# Altium schematic sheet walktimizer_v2.SchDoc
size 431 x 279 mm; SheetNumber: 1; SheetTotal: 1; ENG_APP_DATE: --/--/--; DSN_APP_DATE: --/--/--; CHK_APP_DATE: --/--/--
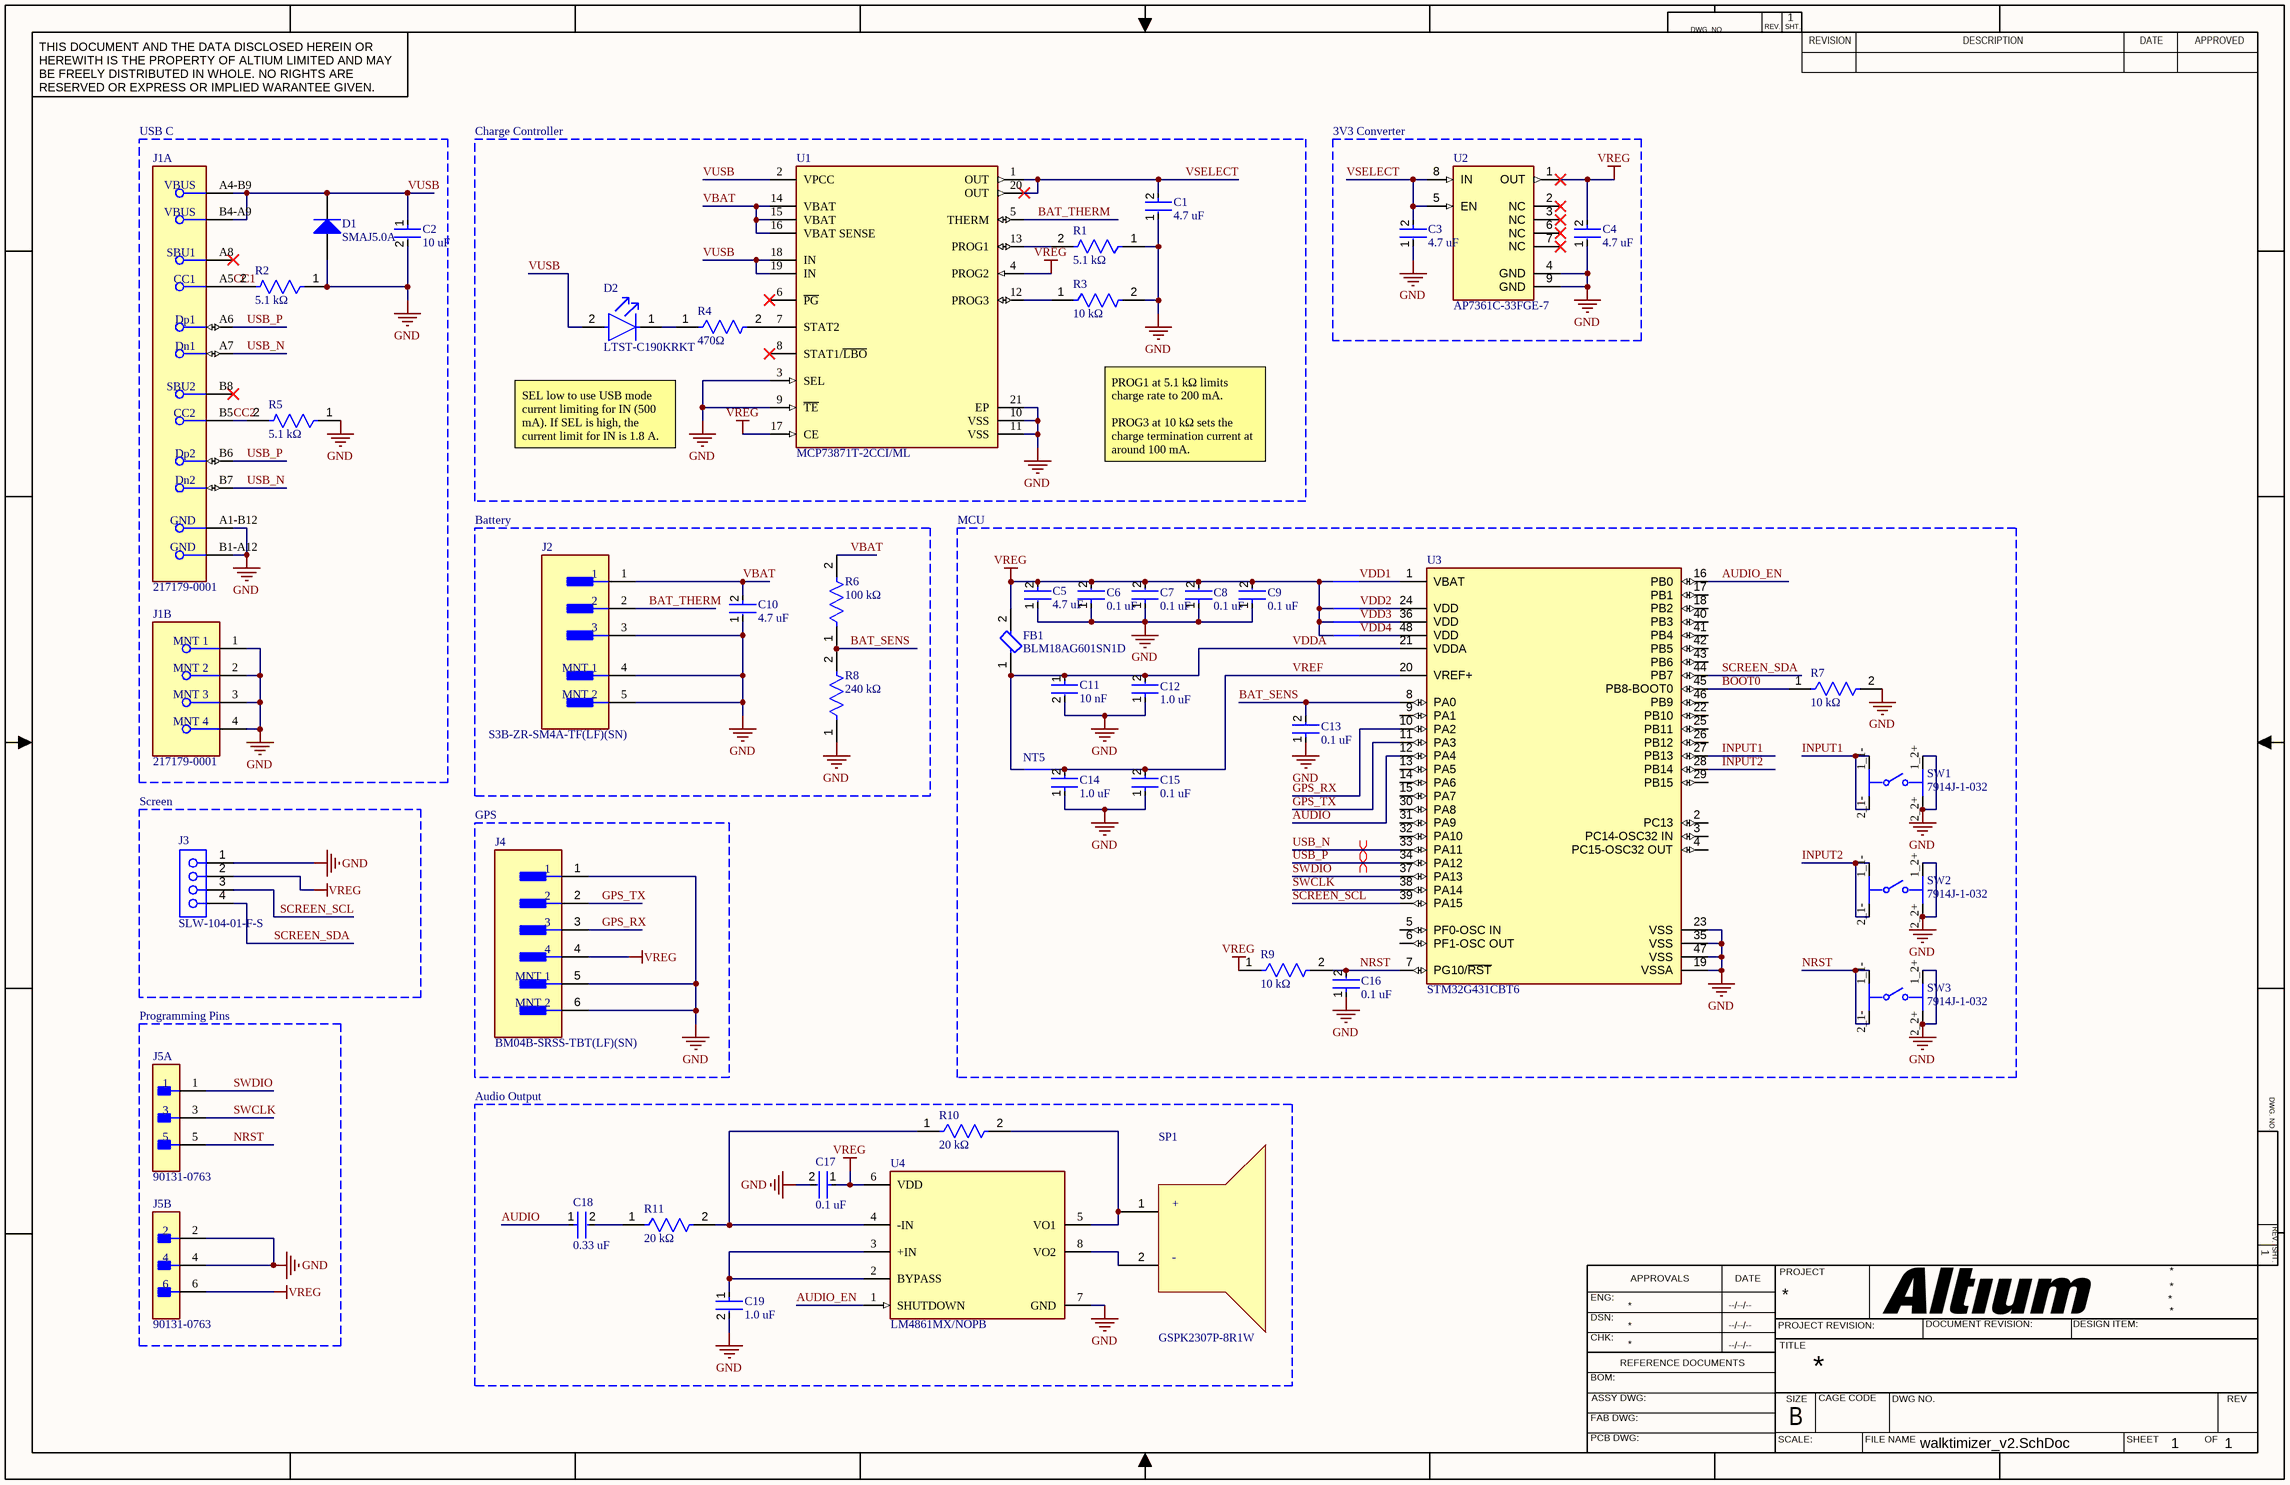
[diagram p0: walktimizer_v2.SchDoc]

## Parts
C1  4.7 uF  [FP-GRM188-0_1-MFG]
C2  10 uF  [FP-GRM21B-0_2-e0_2_0_7-IPC_A]
C3  4.7 uF  [FP-GRM188-0_1-MFG]
C4  4.7 uF  [FP-GRM188-0_1-MFG]
C5  4.7 uF  [FP-GRM188-0_1-MFG]
C6  0.1 uF  [FP-CC0603-DA-MFG]
C7  0.1 uF  [FP-CC0603-DA-MFG]
C8  0.1 uF  [FP-CC0603-DA-MFG]
C9  0.1 uF  [FP-CC0603-DA-MFG]
C10  4.7 uF  [FP-GRM188-0_1-MFG]
C11  10 nF  [FP-CC0603-DA-MFG]
C12  1.0 uF  [FP-CC0603-DB-MFG]
C13  0.1 uF  [FP-CC0603-DA-MFG]
C14  1.0 uF  [FP-CC0603-DB-MFG]
C15  0.1 uF  [FP-CC0603-DA-MFG]
C16  0.1 uF  [FP-CC0603-DA-MFG]
C17  0.1 uF  [FP-CC0603-DA-MFG]
C18  0.33 uF  [FP-CC0603-DA-MFG]
C19  1.0 uF  [FP-CC0603-DB-MFG]
D1  SMAJ5.0A  [BOUR-SMA-2_V]
D2  LTST-C190KRKT  [FP-LTST-C190KRKT-MFG]
FB1  BLM18AG601SN1D  [FP-BLM18-0_15-t0_8-MFG]
J1  217179-0001  [FP-2171790001-MFG]  (parts A,B of 2)
J2  S3B-ZR-SM4A-TF(LF)(SN)  [FP-S3B-ZR-SM4A-TF_LF_SN-MFG]
J3  SLW-104-01-F-S  [SMTC-SLW-104-01-X-S]
J4  BM04B-SRSS-TBT(LF)(SN)  [FP-BM04B-SRSS-TBT_LF_SN-MFG]
J5  90131-0763  [FP-90131-0763-MFG]  (parts A,B of 2)
NT1  NT  [NETTIE_SMD]  (value not drawn)  (net tie, no BOM)
NT2  NT  [NETTIE_SMD]  (value not drawn)  (net tie, no BOM)
NT3  NT  [NETTIE_SMD]  (value not drawn)  (net tie, no BOM)
NT4  NT  [NETTIE_SMD]  (value not drawn)  (net tie, no BOM)
NT5  NT  [NETTIE_SMD]  (value not drawn)  (net tie, no BOM)
R1  5.1 kΩ  [FP-CRCW0603-e3-IPC_C]
R2  5.1 kΩ  [FP-CRCW0603-e3-IPC_C]
R3  10 kΩ  [FP-RC0603-0_55-IPC_C]
R4  470Ω  [FP-CRCW0603-e3-MFG]
R5  5.1 kΩ  [FP-CRCW0603-e3-IPC_C]
R6  100 kΩ  [FP-RC0603-0_55-MFG]
R7  10 kΩ  [FP-RC0603-0_55-IPC_C]
R8  240 kΩ  [FP-RT0603-MFG]
R9  10 kΩ  [FP-RC0603-0_55-IPC_C]
R10  20 kΩ  [FP-RC0603-0_55-IPC_C]
R11  20 kΩ  [FP-RC0603-0_55-IPC_C]
SP1  GSPK2307P-8R1W  [GSPK2307P-8R1W-Footprint-1]
SW1  7914J-1-032  [FP-7914J-1-032-MFG]
SW2  7914J-1-032  [FP-7914J-1-032-MFG]
SW3  7914J-1-032  [FP-7914J-1-032-MFG]
U1  MCP73871T-2CCI/ML  [FP-C04-126-IPC_C]
U2  AP7361C-33FGE-7  [FP-U-DFN3030-8_Type_E-MFG]
U3  STM32G431CBT6  [FP-LQFP48-5B-MFG]
U4  LM4861MX/NOPB  [FP-D0008A-MFG]

## Blocks framed on the sheet
USB C: C2 D1 J1 R2 R5
Charge Controller: C1 D2 R1 R3 R4 U1
3V3 Converter: C3 C4 U2
Battery: C10 J2 R6 R8
MCU: C5-C9 C11-C16 FB1 NT1-NT5 R7 R9 SW1-SW3 U3
Screen: J3
GPS: J4
Programming Pins: J5
Audio Output: C17-C19 R10 R11 SP1 U4

## Nets
GND: C1.1 C2.2 C3.1 C4.1 C5.1 C6.1 C7.1 C8.1 C9.1 C10.1 C11.2 C12.1 C13.1 C14.1 C15.1 C16.1 C17.2 C19.2 D1.1(A) J1.1(MNT_1) J1.2(MNT_2) J1.3(MNT_3) J1.4(MNT_4) J1.A1-B12(GND) J1.B1-A12(GND) J2.3 J2.4(MNT_1) J2.5(MNT_2) J3.1 J4.1 J4.5(MNT_1) J4.6(MNT_2) J5.2 J5.4 R1.1 R2.1 R3.2 R5.1 R7.2 R8.1 SW1.1_2+(1_2+) SW1.2_2+(2_2+) SW2.1_2+(1_2+) SW2.2_2+(2_2+) SW3.1_2+(1_2+) SW3.2_2+(2_2+) U1.3(SEL) U1.9(~{TE}) U1.10(VSS) U1.11(VSS) U1.21(EP) U2.4(GND) U2.9(GND) U3.19(VSSA) U3.23(VSS) U3.35(VSS) U3.47(VSS) U4.7(GND)
VREG: C4.2 C5.2 C6.2 C7.2 C8.2 C9.2 C17.1 FB1.2 J3.2 J4.4 J5.6 NT1.1 NT2.1 NT3.1 NT4.1 R9.1 U1.4(PROG2) U1.17(CE) U2.1(OUT) U4.6(VDD)
AUDIO: C18.1 U3.12(PA4)
AUDIO_EN: U3.16(PB0) U4.1(SHUTDOWN)
BAT_SENS: C13.2 R6.1 R8.2 U3.8(PA0)
BAT_THERM: J2.2 U1.5(THERM)
BOOT0: R7.1 U3.45(PB8-BOOT0)
CC1: J1.A5(CC1) R2.2
CC2: J1.B5(CC2) R5.2
GPS_RX: J4.3 U3.10(PA2)
GPS_TX: J4.2 U3.11(PA3)
INPUT1: SW1.1_1-(1_1-) SW1.2_1-(2_1-) U3.27(PB13)
INPUT2: SW2.1_1-(1_1-) SW2.2_1-(2_1-) U3.28(PB14)
NRST: C16.2 J5.5 R9.2 SW3.1_1-(1_1-) SW3.2_1-(2_1-) U3.7(PG10/~{RST})
SCREEN_SCL: J3.3 U3.39(PA15)
SCREEN_SDA: J3.4 U3.44(PB7)
SWCLK: J5.3 U3.38(PA14)
SWDIO: J5.1 U3.37(PA13)
USB_N: J1.A7(Dn1) J1.B7(Dn2) U3.33(PA11)
USB_P: J1.A6(Dp1) J1.B6(Dp2) U3.34(PA12)
VBAT: C10.2 J2.1 R6.2 U1.14(VBAT) U1.15(VBAT) U1.16(VBAT_SENSE)
VDD1: NT1.2 U3.1(VBAT)
VDD2: NT2.2 U3.24(VDD)
VDD3: NT3.2 U3.36(VDD)
VDD4: NT4.2 U3.48(VDD)
VDDA: C11.1 C12.2 FB1.1 NT5.1 U3.21(VDDA)
VREF: C14.2 C15.2 NT5.2 U3.20(VREF+)
VSELECT: C1.2 C3.2 U1.1(OUT) U1.20(OUT) U2.5(EN) U2.8(IN)
VUSB: C2.1 D1.2(K) D2.2(A) J1.A4-B9(VBUS) J1.B4-A9(VBUS) U1.2(VPCC) U1.18(IN) U1.19(IN)
NetC18_2: C18.2 R11.1
NetC19_1: C19.1 U4.2(BYPASS) U4.3(+IN)
NetD2_1: D2.1(C) R4.1
NetR1_2: R1.2 U1.13(PROG1)
NetR3_1: R3.1 U1.12(PROG3)
NetR4_2: R4.2 U1.7(STAT2)
NetR10_1: R10.1 R11.2 U4.4(-IN)
NetR10_2: R10.2 SP1.1 U4.5(VO1)
NetSP1_2: SP1.2 U4.8(VO2)

Not connected (* = marked no-connect by the designer): J1 A8(SBU1)* B8(SBU2)*; U1 6(~{PG})* 8(STAT1/~{LBO})*; U2 2(NC)* 3(NC)* 6(NC)* 7(NC)*; U3 2(PC13) 3(PC14-OSC32_IN) 4(PC15-OSC32_OUT) 5(PF0-OSC_IN) 6(PF1-OSC_OUT) 9(PA1) 13(PA5) 14(PA6) 15(PA7) 17(PB1) 18(PB2) 22(PB10) 25(PB11) 26(PB12) 29(PB15) 30(PA8) 31(PA9) 32(PA10) 40(PB3) 41(PB4) 42(PB5) 43(PB6) 46(PB9)

## Layout directives
differential pair: USB_N, USB_P

## Notes on the sheet
- SEL low to use USB mode current limiting for IN (500 mA). If SEL is high, the current limit for IN is 1.8 A.
- PROG1 at 5.1 kΩ limits charge rate to 200 mA.
  PROG3 at 10 kΩ sets the charge termination current at around 100 mA.
- DWG. NO.
- REV.
- SHT.
- THIS DOCUMENT AND THE DATA DISCLOSED HEREIN OR HEREWITH IS THE PROPERTY OF ALTIUM LIMITED AND MAY BE FREELY DISTRIBUTED IN WHOLE. NO RIGHTS ARE RESERVED OR EXPRESS OR IMPLIED WARANTEE GIVEN.
- REVISION
- DESCRIPTION
- DATE
- APPROVED
- ENG:
- APPROVALS
- PROJECT
- DSN:
- CHK:
- REFERENCE DOCUMENTS
- PROJECT REVISION:
- TITLE
- DOCUMENT REVISION:
- DESIGN ITEM:
- BOM:
- FAB DWG:
- PCB DWG:
- ASSY DWG:
- SCALE:
- SIZE
- B
- CAGE CODE
- FILE NAME
- DWG NO.
- SHEET
- OF
- REV
- (in symbol CMP-00027-00003-3) +; -

## Library data of the parts
C1 C3-C5 C10 = CMP-2006-02799-3: CAP CER 4.7UF 6.3V X5R 0603 / GRM188R60J475KE19D; Material: Ceramic; Tolerance: 10%; Max Operating Temperature: 85°C; REACH SVHC: No SVHC; Thickness: 0.035inch; Voltage Rating: 6.3V; Package Quantity: 1; Radiation Hardening: No; Capacitance: 4.7uF; Voltage: 6.3V; Case Code (Metric): 1608; Dielectric: X5R; Mount: Surface Mount; RoHS Compliant: Yes; Height: 0.8mm; Voltage Rating (DC): 6.3V; Width: 0.8mm; Lead Free: Lead Free; Case Code (Imperial): 0603; Packaging: Tape and Reel; Length: 1.6mm; Case/Package: 0603; Termination: SMD/SMT; Min Operating Temperature: -55°C; Depth: 0.8mm
C2 = CMP-06035-004402-1: Chip Multilayer Ceramic Capacitors for General Purpose, 0805, 10uF, X5R, 15%, 10%, 50V / GRM21BR61H106KE43L; Voltage Rating (DC): 50V; Dielectric: X5R; Tolerance: 10%; Capacitance: 10uF; Thickness: 1.25mm; Length: 2mm; Width: 1.25mm
C6-C9 C13 C15-C17 = CMP-2100-03601-2: CAP CER 0.1UF 50V X7R 0603 / CC0603KRX7R9BB104; Manufacturer: YAGEO; Material: Ceramic; Capacitance: 100 nF; Temperature Coefficient: 15%; Tolerance: 0.1; Value: 100 nF; Height: 0.9mm; Voltage: 50 V; ComponentLink2Description: Datasheet; Device Class L2: Capacitors; Temperature Range High: +125°C; Category: Cap; Footprint Url: http://www.yageo.com/exep/pages/download/literatures/UPY-C_GEN_24.pdf; ComponentLink2URL: http://www.yageo.com/documents/recent/UPY-GPHC_X7R_6.3V-to-50V_18.pdf; Package: CC0603-DA; Temperature: -55°C to +125°C; Voltage Rating: 50 V; Temperature Characteristic: X7R; Device Class L1: Passive Components; Temperature Range Low: -55°C; Manufacturer Part Number: CC0603KRX7R9BB104; RoHS: TRUE; Automotive: No; Device Class L3: Ceramic Capacitors; Octopart: https://octopart.com/cc0603krx7r9bb104-yageo-42244635; Mouser Description: Multilayer Ceramic Capacitor, CC Series, 0.1 - F, - 10%, X7R, 50 V, 0603 [1608 Metric]; Lead Free: Yes; Digikey Description: CAP CER 0.1UF 50V X7R 0603
C11 = CMP-2100-03600-2: CAP CER 10000PF 50V X7R 0603 / CC0603KRX7R9BB103; Manufacturer: YAGEO; Tolerance: 0.1; Material: Ceramic; Temperature Coefficient: 15%; Mouser Description: Multilayer Ceramic Capacitor, CC Series, 0.01 - F, - 10%, X7R, 50 V, 0603 [1608 Metric]; Digikey Description: CAP CER 10000PF 50V X7R 0603; Height: 0.9mm; Category: Cap; Temperature Characteristic: X7R; Footprint Url: http://www.yageo.com/exep/pages/download/literatures/UPY-C_GEN_24.pdf; Lead Free: Yes; Voltage Rating: 50 V; Manufacturer Part Number: CC0603KRX7R9BB103; Temperature: -55°C to +125°C; Device Class L3: Ceramic Capacitors; ComponentLink2Description: Datasheet; Voltage: 50 V; Package: CC0603-DA; Octopart: https://octopart.com/cc0603krx7r9bb103-yageo-192938; Automotive: No; Temperature Range High: +125°C; Temperature Range Low: -55°C; Value: 10 nF; RoHS: TRUE; Device Class L1: Passive Components; ComponentLink2URL: http://www.yageo.com/documents/recent/UPY-GPHC_X7R_6.3V-to-50V_18.pdf; Device Class L2: Capacitors; Capacitance: 10 nF
C12 C14 C19 = CMP-03422-000761-2: CAP CER 1UF 50V X7R 0603 / CC0603KRX7R9BB105; Tolerance: 10%; Lead Free: Lead Free; Max Operating Temperature: 125°C; Width: 0.031inch; Voltage Rating: 50V; Mount: Surface Mount; Resistor Type: Ceramic; Halogen Free: Halogen Free; Weight: 7.1E-05oz; Voltage Rating (DC): 50V; Package Quantity: 4000; Termination: SMD/SMT; Length: 0.063inch; Min Operating Temperature: -55°C; Dielectric: X7R; Case Code (Metric): 1608; Case Code (Imperial): 0603; Packaging: Tape and Reel; Thickness: 0.035inch; Capacitance: 1uF; Case/Package: 0603
C18 = CMP-03422-001097-1: CAP CER 0.33UF 25V X7R 0603 / CC0603KRX7R8BB334; Manufacturer: YAGEO; Temperature Coefficient: 15%; Value: 330 nF; Material: Ceramic; Tolerance: 0.1; Voltage: 25 V; Device Class L3: Ceramic Capacitors; Device Class L2: Capacitors; Voltage Rating: 25 V; Mouser Description: 0603 0.33 uF 25 V ±10 % Tolerance X7R SMT Multilayer Ceramic Capacitor; Automotive: No; ComponentLink2Description: Datasheet; Lead Free: Yes; Height: 0.9mm; Temperature: -55°C to +125°C; Capacitance: 330 nF; Digikey Description: CAP CER 0.33UF 25V X7R 0603; Temperature Range High: +125°C; Octopart: https://octopart.com/cc0603krx7r8bb334-yageo-47255252; Category: Cap; Package: CC0603-DA; Device Class L1: Passive Components; RoHS: TRUE; Manufacturer Part Number: CC0603KRX7R8BB334; Temperature Characteristic: X7R; ComponentLink2URL: http://www.yageo.com/documents/recent/UPY-GPHC_X7R_6.3V-to-50V_18.pdf; Temperature Range Low: -55°C; Footprint Url: http://www.yageo.com/exep/pages/download/literatures/UPY-C_GEN_24.pdf
D1 = CMP-2000-07090-1: SMAJ Transient Voltage Suppressor Diode Series, 3.5 V, -55 to 150 degC, 2-Pin SMA, RoHS, Tape and Reel; Manufacturer: Bourns; EDA / CAD Models: DownloadfromAcceleratedDesigns; Unidirectional Channels: 1; Voltage - Breakdown (Min): 6.4V; Voltage - Reverse Standoff (Typ): 5V; Voltage - Clamping (Max) @ Ipp: 9.2V; Other Names: SMAJ5.0ABDKR; Type: Zener; Catalog Drawings: SMAJSeriesFootprintSMAJ,SMBJSeries; Featured Product: SMAJ/SMBJ/SMCJ/SMLJDiscreteTVSDiodes; Power - Peak Pulse: 400W; Current - Peak Pulse (10/1000µs): 43.5A; Power Line Protection: No; Online Catalog: SMAJSeries; Supplier Device Package: SMA(DO-214AC); Operating Temperature: -55°C~150°C(TJ); Package Description: 2-Pin Surface Mount Device, Body 4.315 x 2.605 mm; Datasheet URL: https://datasheet.ciiva.com/25624/0900766b8112213b-25624680.pdf; Manufacturer URL: http://www.bourns.com/; Datasheet Version: 08/2012; Series: SMAJ; Family: TVS-Diodes; Bidirectional Channels: -; Applications: GeneralPurpose; Package Reference: SMA-2; Standard Package: 1; Package / Case: DO-214AC,SMA; Category: CircuitProtection; RoHS Information: SMAJSeriesMaterialDeclaration; Mounting Technology: SurfaceMount; Capacitance @ Frequency: -; Packaging: Digi-Reel®; Mounting Type: SurfaceMount
D2 = CMP-1674-00011-2: LED RED CLEAR CHIP SMD; Reverse Voltage: 5V; Viewing Angle: 130°; Power Rating: 75mW; Test Current: 20mA; Number of Elements: 1; Lens Color: Colorless; Wavelength: 639nm; Dominant Wavelength: 631nm; Lens Style: Diffused; Forward Current: 30mA; Forward Voltage: 2.4V; Luminous Intensity: 54mcd; Color: Red; Case Code (Imperial): 0603; Lens Transparency: Clear; Lead Free: Lead Free; Package Quantity: 1; Packaging: Tape and Reel; Max Operating Temperature: 85°C; Number of Pins: 2; Height: 0.8mm; Case/Package: 0603; Number of LEDs: 1; Width: 0.8mm; Case Code (Metric): 1608; Depth: 0.8mm; Mount: Surface Mount; Radiation Hardening: No; Length: 1.6mm; Illumination Color: Red; Power Dissipation: 75mW; Min Operating Temperature: -55°C
FB1 = CMP-0686-00436-3: Chip Ferrite Bead, 0603, 600Ω @ 100MHz, 0.38Ω, 25%, 500mA; Number of Lines: 1; Impedance: 600R; DC Resistance (DCR): 380mR; Material: Steel; Shielding: Unshielded; Max DC Current: 500mA; Termination: SMD/SMT; Military Standard: Not; Number of Circuits: 1; Min Operating Temperature: -55°C; Case Code (Imperial): 0603; Width: 0.8mm; Current Rating: 500mA; Lead Free: Lead Free; Packaging: Tape and Reel; Frequency: 100MHz; Max Operating Temperature: 125°C; DC Current: 500mA; REACH SVHC: No SVHC; Case/Package: 0603; Package Quantity: 1; Height: 0.8mm; Number of Pins: 2; Depth: 0.8mm; Test Frequency: 100MHz; Case Code (Metric): 1608; Tolerance: 25%; Core Material: Ferrite; Weight: 7.1E-05oz; Max Current Rating: 500mA; Radiation Hardening: No; Length: 1.6mm; RoHS Compliant: Yes
J1 = CMP-04767-000028-2: CONN RCP USB2.0 TYP C 24P SMD RA; NexarPartId: 117190526; Gender: Receptacle; Number of Contacts: 16; Current Rating: 1.25A; Voltage Rating: 30V; Min Operating Temperature: -40°C; USB Standard: USB 2.0; Height: 3.36mm; Contact Material: Gold, Nickel; Max Operating Temperature: 85°C
J2 = CMP-17439-000744-1: CONN HEADER SMD R/A 3POS 1.5MM; Number of Contacts: 3; Contact Resistance: 30mR; Gender: Male; Voltage Rating: 50V; Max Current Rating: 1A; Orientation: Right Angle; Flammability Rating: UL94 V-0; Housing Color: Beige; Insulation Material: Nylon; Max Operating Temperature: 85°C; Min Operating Temperature: -25°C; Packaging: Tape and Reel; Contact Shape: Circular; Depth: 6.5mm; Mount: Surface Mount; Insulation Color: Natural; Width: 3.5mm; Number of Rows: 1; Termination: Solder; Color: Natural; Contact Plating: Copper; Contact Type: Male Pin; Pitch: 1.5mm; Length: 7.5mm; Number of Positions: 3; Housing Material: Polyamide; Max Voltage Rating (AC): 50V; Fastening Type: Detent; Lead Free: Lead Free; Series: ZH; Contact Finish - Mating: TIN; Connector Type: Header; Current Rating: 1A; Contact Material: Brass; Height: 7.2mm
J3 = CMP-1023-00132-1: Low Profile Socket Strips, Through-hole, Vertical, -55 to 125 degC, 2.54 mm Pitch, 4-Pin, Female, RoHS; Manufacturer: Samtec; Pitch: 2.54 mm; PackageVersion: X, 9/1987; ComponentLink2Description: Datasheet; PackageDescription: Low Profile Socket Strip; ComponentLink1URL: http://www.samtec.com; Orientation: Vertical; ComponentLink3URL: http://www.samtec.com/documents/webfiles/cpdf/SLW-1XX-01-X-X-MKT.pdf; ComponentLink1Description: Manufacturer URL; ComponentLink2URL: http://www.samtec.com/documents/webfiles/pdf/SLW.PDF; PackageReference: SLW-104-01-X-S; Mounting Technology: Through-hole; PartNumber: SLW-104-01-F-S; Temperature Range: -55 to 125 degC; DatasheetVersion: F-214; ComponentLink3Description: Package Specification; RoHS: True
J4 = CMP-17439-000370-1: CONN HEADER SMD 4POS 1MM; Voltage Rating: 50V; Number of Positions: 4; Pitch: 0.039inch; Mated Stacking Heights: 4.9mm; Packaging: Cut Tape; Contact Material: Copper Alloy; Lead Free: Lead Free; Contact Type: Male Pin; Fastening Type: Pull; Connector Type: Header; Contact Finish - Mating: TIN; Series: SR; Number of Rows: 1; Contact Shape: Square; Package Quantity: 1; Color: Natural; Flammability Rating: UL94 V-0; Mount: Surface Mount; Insulation Color: Natural; Termination: Solder; Contact Plating: Tin; Insulation Material: Nylon
J5 = CMP-00257-00655468-1: 90131-0763 Conn Unshrouded Header HDR 6 POS 2.54mm Solder ST Top Entry Thru-Hole C-Grid III™ Tray; NexarPartId: 655468; Manufacturer Lifecycle Status: ACTIVE; Number of Poles: 6; Plating: Tin; Current Rating: 3A; Gender: Male; Voltage Rating (AC): 350V; Contact Resistance: 20mΩ; Insulation Resistance: 5GΩ; Pitch: 2.54mm; Height: 9.65mm; Mount: Through Hole; Termination: Through Hole; Contact Plating: Gold; Orientation: Vertical; Material: Glass, Polyester; Min Operating Temperature: -55°C; Lead Free: Lead Free; REACH SVHC: Unknown; Contact Material: Brass; Housing Color: Black; Schedule B: 8536694040; Number of Rows: 2; Lead Pitch: 2.54mm; Number of Circuits: 6; Number of Positions: 6; Lifecycle Status: Production; Max Operating Temperature: 125°C; Voltage Rating: 350V; Voltage Rating (DC): 350V; Country of Origin: SG; Housing Material: Polyester; RoHS: Compliant; Working Voltage: 350V; Number of Contacts: 6; Radiation Hardening: No
NT1-NT5 = NetTie_SMD: Net Tie SMD
R1 R2 R5 = CMP-1012-00590-3: RES Thick Film, 5.1kΩ, 1%, 0.1W, 100ppm/°C, 0603 / CRCW06035K10FKEA; Power Rating: 100mW; Voltage Rating (DC): 75V; Resistance: 5.1kR; Width: 0.85mm; Depth: 0.85mm; Military Standard: Not; Package Quantity: 5000; Case Code (Metric): 1608; Length: 1.55mm; Weight: 7.1E-05oz; Packaging: Tape and Reel; Temperature Coefficient: 100ppm/°C; Case Code (Imperial): 0603; Lead Free: Lead Free; Radiation Hardening: No; Contact Plating: Tin; Composition: Thick Film; Max Operating Temperature: 155°C; Termination: SMD/SMT; Case/Package: 0603; Min Operating Temperature: -55°C; Tolerance: 1%; Voltage Rating: 75V; Mount: Surface Mount; Height: 0.45mm
R3 R7 R9 = CMP-2100-03664-2: RES 10kΩ 1% 1/10W 0603 / RC0603FR-0710KL; Voltage Rating: 75V; Voltage Rating (DC): 50V; Resistance: 10kR; Power Rating: 100mW; Temperature Coefficient: 100ppm/°C; Depth: 0.8mm; Termination: SMD/SMT; Resistor Type: Thick Film; Series: RC; Construction: Rectangular; Features: Moisture Resistant; Packaging: Tape and Reel; Min Operating Temperature: -55°C; Number of Terminations: 2; Lead Pitch: 0.3mm; RoHS Compliant: Yes; Case/Package: 0603; Resistance Tolerance: 1%; Military Standard: Not; Weight: 7.1E-05oz; Number of Pins: 2; Tolerance: 1%; Length: 1.6mm; Case Code (Imperial): 0603; Lead Free: Lead Free; Width: 0.8mm; Max Power Dissipation: 100mW; Height: 0.45mm; Max Operating Temperature: 155°C; Case Code (Metric): 1608; Size Code: 0603
R4 = CMP-2000-03373-2: RES Thick Film, 470Ω, 1%, 0.1W, 100ppm/°C, 0603 / CRCW0603470RFKEA; Voltage Rating: 75V; Resistance: 470R; Max Power Dissipation: 100mW; Lead Free: Lead Free; Weight: 7.1E-05oz; Composition: Thick Film; Case Code (Imperial): 0603; Height: 0.45mm; Width: 0.033inch; Case/Package: 0603; Package Quantity: 10; Temperature Coefficient: 100ppm/°C; Min Operating Temperature: -55°C; Case Code (Metric): 1608; Radiation Hardening: No; Mount: Surface Mount; Tolerance: 1%; Depth: 0.85mm; Power Rating: 100mW; Length: 1.55mm; Voltage Rating (DC): 75V; Number of Terminations: 2; Contact Plating: Tin; Packaging: Tape and Reel; Termination: SMD/SMT; Features: Automotive AEC-Q200; Max Operating Temperature: 155°C; Military Standard: Not
R6 = CMP-2100-03662-2: RES SMD 100K OHM 1% 1/10W 0603 / RC0603FR-07100KL; Voltage Rating (DC): 50V; Resistance: 100kR; Max Power Dissipation: 100mW; Temperature Coefficient: 100ppm/°C; Working Voltage: 75V; Length: 1.6mm; Lead Free: Lead Free; Number of Terminations: 2; Packaging: Tape and Reel; Voltage Rating: 50V; Termination: SMD/SMT; Width: 0.8mm; Resistor Type: Thick Film; Resistance Tolerance: 1%; Features: Moisture Resistant; Height: 0.45mm; Construction: Rectangular; Case/Package: 0603; Military Standard: Not; Case Code (Imperial): 0603; Series: RC; Technology: THICK FILM; Depth: 0.8mm; RoHS Compliant: Yes; REACH SVHC: No SVHC; Min Operating Temperature: -55°C; Case Code (Metric): 1608; Max Operating Temperature: 155°C; Power Rating: 100mW; Number of Pins: 2; Tolerance: 1%
R8 = CMP-2000-04408-2: RES 240K OHM 1/10W .1% SMD 0603 / RT0603BRD07240KL; Manufacturer: Yageo; Voltage Rating: 75V; Temperature Coefficient: 25 ppm/°C; Resistance: 240KΩ; Tolerance: 0.001; Value: 240KΩ; Power Rating: 0.1W; Footprint Url: http://www.yageo.com/exep/pages/download/literatures/PYu-R_Mount_10.pdf; RoHS: TRUE; Automotive: No; Series: RT; Temperature Range High: +155°C; Device Class L2: Resistors; Package: RT0603; Ipc Land Pattern Name: RESC16080X45; Lead Free: Yes; ComponentLink2URL: http://www.yageo.com/documents/recent/PYu-RT_1-to-0.01_RoHS_L_9.pdf; Octopart: https://octopart.com/rt0603brd07240kl-yageo-1283207; ComponentLink2Description: Datasheet; Mouser Description: Thin Film Resistors 1/10W 240K ohm .1% 25ppm; Digikey Description: RES 240K OHM 1/10W .1% SMD 0603; Temperature Range Low: -55°C; Device Class L3: Chip SMD Resistors; Manufacturer Part Number: RT0603BRD07240KL; Category: Res; Composition: Thin Film; Temperature: -55°C to +155°C; Device Class L1: Passive Components; Height: 0.55mm
R10 R11 = CMP-2000-06932-2: RES 20K OHM 1% 1/10W 0603 / RC0603FR-0720KL; Voltage Rating: 50V; Temperature Coefficient: 100ppm/°C; Power Rating: 100mW; Resistance: 20kR; Height: 0.022inch; REACH SVHC: No SVHC; Case Code (Metric): 1608; Depth: 0.8mm; Tolerance: 1%; Min Operating Temperature: -55°C; Series: RC; RoHS Compliant: Yes; Resistor Type: Thick Film; Max Power Dissipation: 100mW; Features: Moisture Resistant; Max Operating Temperature: 155°C; Package Quantity: 1; Size Code: 0603; Packaging: Tape and Reel; Width: 0.031inch; Length: 0.063inch; Military Standard: Not; Technology: THICK FILM; Number of Terminations: 2; Termination: SMD/SMT; Construction: Rectangular; Case/Package: 0603; Number of Pins: 2; Lead Free: Lead Free; Voltage Rating (DC): 50V; Resistance Tolerance: 1%; Case Code (Imperial): 0603
SP1 = CMP-00027-00003-3: 8 ohm 1.7kHz Speakers ROHS 88dB 500 mW
SW1-SW3 = CMP-07427-000007-1: SWITCH TACTILE SPST-NO 0.1A 16V; Mechanical Life: 100000Cycles; Switch Function: Off-Mom; Actuator Material: Rubber; Illumination Type: Non-Illuminated; Actuator Type: Standard; Operating Force: 300gf; Throw Configuration: SPST; Current Rating: 100mA; Contact Plating: Silver; Min Operating Temperature: -55°C; Series: 7914; Package Quantity: 50; Max Operating Temperature: 125°C; Depth: 5mm; Termination: J-Hook; Mount: Surface Mount; RoHS Compliant: Yes; Case/Package: SMD/SMT; Voltage Rating (DC): 16V; Orientation: Straight; Max Current Rating: 100mA; Packaging: Rail/Tube; Length: 5mm; Contact Material: Gold
U1 = CMP-06318-000014-1: IC USB/AC BATT CHRGR W/PPM 20QFN; Min Supply Voltage: 4.5V; Output Current: 1A; Output Voltage: 4.2V; Max Supply Voltage: 6V; Case/Package: QFN; RoHS Compliant: Yes; Min Operating Temperature: -40°C; Mount: Surface Mount; Package Quantity: 3300; Packaging: Tape and Reel; Number of Pins: 20; Max Operating Temperature: 85°C; Lead Free: Lead Free; Contact Plating: Tin
U2 = CMP-12756-000002-1: IC REG LINEAR 3.3V 1A UDFN3030-8; Manufacturer: Diodes Inc.; Standoff Height: 0mm; Nominal Supply Current: 60uA; Number Of Outputs: 1; Max Junction Temp: +150°C; Output Type: Fixed; Dropout Voltage: 840mV; Min Supply Voltage: 2.2V; Max Power Dissipation: 1700mW; Accuracy Percentage: 1%; Max Supply Voltage: 6V; Ipc Land Pattern Name: DFN300X300X60-8; Footprint Url: https://www.diodes.com/assets/Package-Files/U-DFN3030-8-Type-E.pdf; Output Voltage: 3.3V; Manufacturer Part Number: AP7361C-33FGE-7; Device Class L3: Voltage Regulators - Linear; Temperature: -40°C to +150°C; Temperature Range High: +150°C; Mouser Description: LDO Voltage Regulators 1A LDO Reg w/Enable 3.3V 6.5Vin 1700mW; Height: 0.63mm; Ambient Temperature Range High: +85°C; ComponentLink2Description: Datasheet; Automotive: No; Output Current: 1A; Octopart: https://octopart.com/ap7361c-33fge-7-diodes+inc.-65869522; Package: U-DFN3030-8 (Type E); Digikey Description: IC REG LINEAR 3.3V 1A UDFN3030-8; Lead Free: Yes; Category: IC; Device Class L1: Integrated Circuits (ICs); Ambient Temperature Range Low: -40°C; Device Class L2: Power Management ICs; RoHS: TRUE; Temperature Range Low: -40°C; ComponentLink2URL: https://www.diodes.com/assets/Datasheets/AP7361C.pdf
U3 = CMP-12105-000030-1: MAINSTREAM ARM CORTEX-M4+ MCU 17; Manufacturer: STMicroelectronics; Number Of Adc Channels: 17; Number Of I/Os: 38; Standoff Height: 0.05mm; Number Of Usb Channels: 1; Data Bus Width: 32bits; Number Of I2C Channels: 3; Number Of Pwm Channels: 31; Frequency: 170MHz; Memory Type: FLASH; Number Of Timers/Counters: 14; Ram Size: 32KBytes; Max Junction Temp: +105°C; Memory Size: 128KBytes; Min Supply Voltage: 1.62V; Max Supply Voltage: 3.6V; Number Of Uart Channels: 4; Interface: I2C,SPI,UART,USART,CAN,USB,LIN,IrDA,I2S; Temperature Range Low: -40°C; Lead Free: Yes; Device Class L3: Microcontrollers; Number Of Cores: 1; Temperature Range High: +85°C; Height: 1.6mm; Digikey Description: MAINSTREAM ARM CORTEX-M4+ MCU 17; Device Class L1: Integrated Circuits (ICs); Package: LQFP48-5B; RoHS: TRUE; Number Of A/D Converters: 1; Core Architecture: Arm Cortex-M4; Device Class L2: Embedded Processors and Controllers; ComponentLink2Description: Datasheet; Temperature: -40°C to +85°C; Ambient Temperature Range High: +85°C; Ambient Temperature Range Low: -40°C; Octopart: https://octopart.com/stm32g431cbt6-stmicroelectronics-98835224; ComponentLink2URL: https://www.st.com/resource/en/datasheet/stm32g431cb.pdf; Automotive: No; Number Of Spi Channels: 3; Manufacturer Part Number: STM32G431CBT6; Category: IC
U4 = CMP-04894-000007-1: IC AMP CLASS AB MONO 1.5W 8SOIC; Min Supply Voltage: 2V; Number of Channels: 1; Max Supply Voltage: 5.5V; Quiescent Current: 6.5mA; Supply Type: Single; Power Supply Rejection Ratio (PSRR): 65dB; Output Power: 1.1W; Load Impedance: 8R; Operating Supply Voltage: 5V; RoHS Compliant: Yes; Package Quantity: 2500; Contact Plating: Tin; Max Operating Temperature: 85°C; Max Output Power: 1.5W; Number of Pins: 8; Case/Package: SOIC; REACH SVHC: No SVHC; Mount: Surface Mount; Series: Boomer®; Packaging: Tape and Reel; Nominal Supply Current: 6.5mA; Min Operating Temperature: -40°C; Radiation Hardening: No; Lead Free: Lead Free